# EasyEDA schematic SCH_snap_2025-01-24.json
TITLE: Sheet_1; REV: 1.0; Date: 2025-01-24; Sheet: 1/1; Drawn By: piscitello284; Company: Your Company
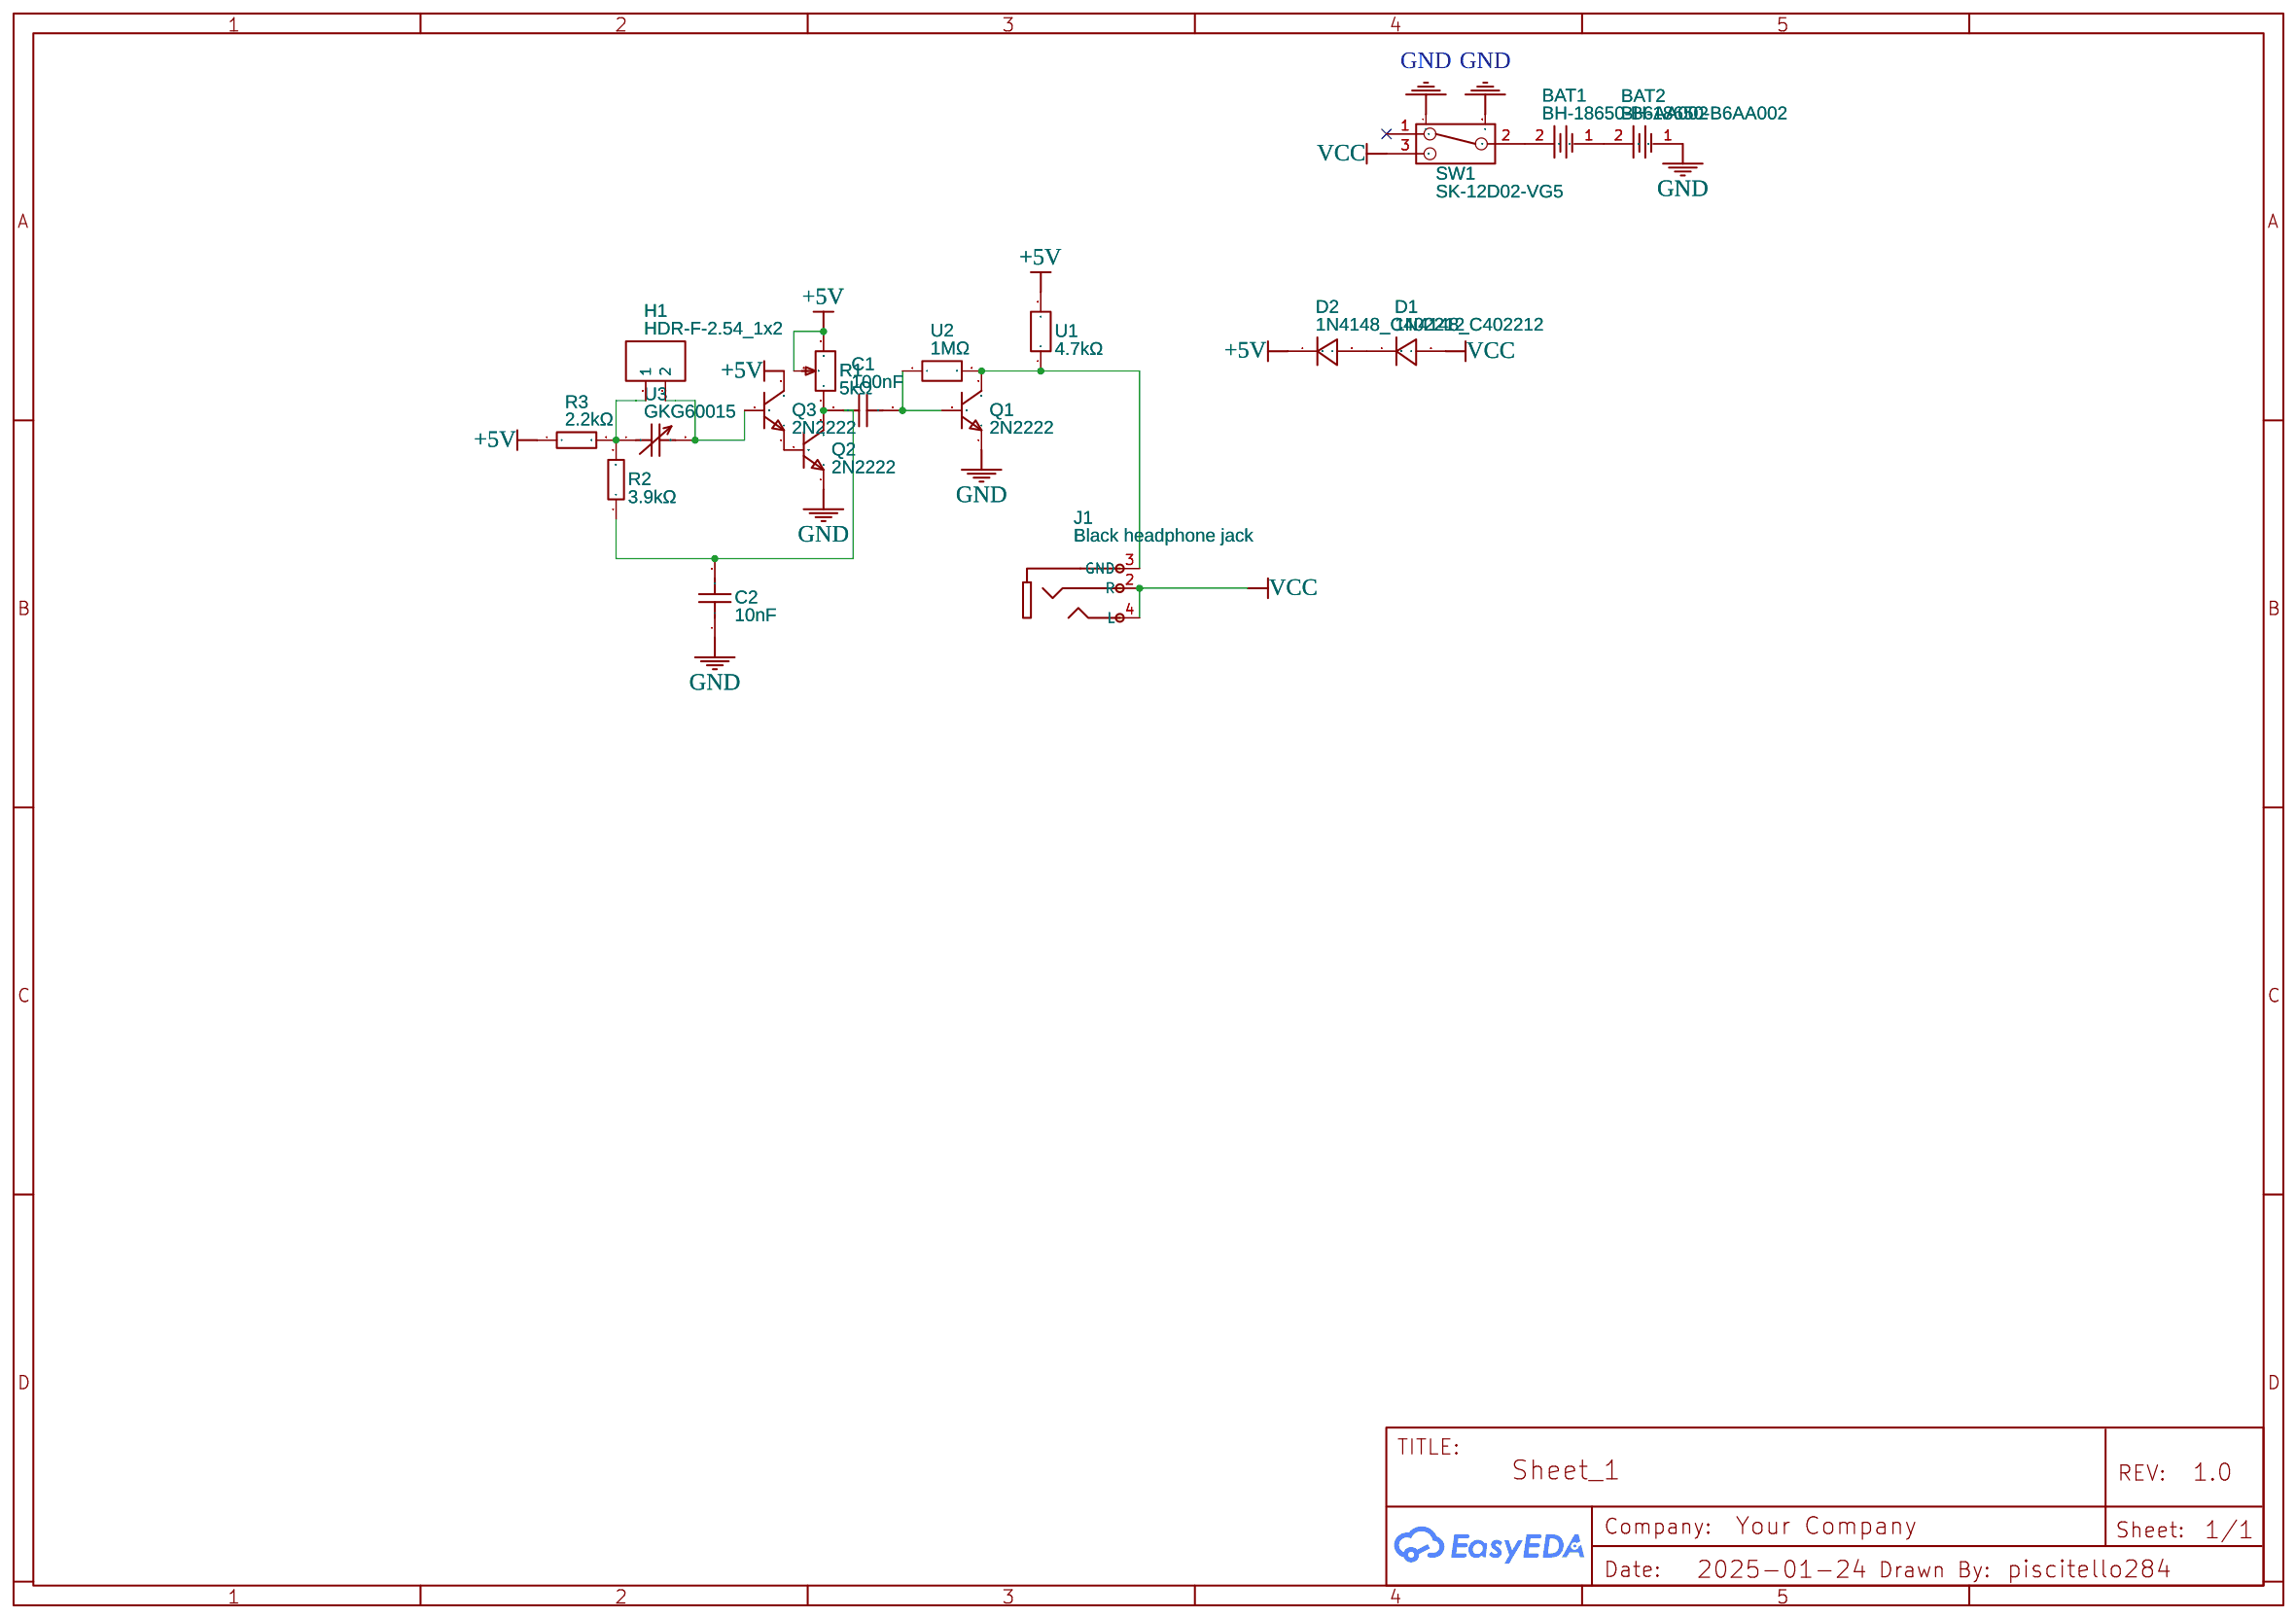
[diagram p0: schematic sheet]

## Parts
BAT1  BH-18650-B6AA002  [BATTERY-SMD_18650-1S-L77.1-W20.7-1]
BAT2  BH-18650-B6AA002  [BATTERY-SMD_18650-1S-L77.1-W20.7-1]
C1  100nF  [CAP-TH_L18.0-W6.0-P15.00-D0.8]
C2  10nF  [CAP-TH_BD2.6-L3.8-P7.80-D0.5]
D1  1N4148_C402212  [DO-35_BD2.0-L4.2-P8.20-D0.5-RD]
D2  1N4148_C402212  [DO-35_BD2.0-L4.2-P8.20-D0.5-RD]
H1  HDR-F-2.54_1x2  [HDR-F-2.54_1X2]
J1  Black headphone jack  [AUDIO-TH_PJ-3200]
Q1  2N2222  [TO-92-3_L4.9-W3.7-P1.27-L]
Q2  2N2222  [TO-92-3_L4.9-W3.7-P1.27-L]
Q3  2N2222  [TO-92-3_L4.9-W3.7-P1.27-L]
R1  5kΩ  [RES-ADJ-TH_3P-L9.5-W9.5-P2.50-L_3386P]
R2  3.9kΩ  [R0603]
R3  2.2kΩ  [R0805]
SW1  SK-12D02-VG5  [SW-TH_SK-12D02VG3]
U1  4.7kΩ  [R2512]
U2  1MΩ  [R0603]
U3  GKG60015  [CAP-TH_GKG60015]

## Library data of the parts
BAT1 BAT2 = BH-18650-B6AA002: Supplier: LCSC; Supplier Part: C7525438; Manufacturer: MYOUNG(美阳); Contributor: lcsc; JLCPCB Part Class: Extended Part
C1 = PX104K2W1502: Contributor: lcsc; Supplier: LCSC; Supplier Part: C3019059; Manufacturer: KYET(科雅); JLCPCB Part Class: Extended Part
C2 = A103K15X7RF5TAA: Contributor: lcsc; Supplier: LCSC; Supplier Part: C3000875; Manufacturer: VISHAY(威世); JLCPCB Part Class: Extended Part
D1 D2 = 1N4148_C402212: Contributor: LCSC; Supplier: LCSC; Supplier Part: C402212; Manufacturer: LGE(鲁光); Manufacturer Part: 1N4148; JLCPCB Part Class: Extended Part
H1 = HDR-F-2.54_1x2: Supplier Part: C49661; Supplier: LCSC; Contributor: LCEDA_Lib
J1 = Black headphone jack: Supplier: LCSC; Manufacturer: BOOMELE(博穆精密); Manufacturer Part: 320B直插; Supplier Part: C18166; JLCPCB Part Class: Extended Part
Q1-Q3 = 2N2222: Contributor: LCSC; Supplier: LCSC; Manufacturer: ST(先科); Manufacturer Part: 2N2222A; Supplier Part: C118536; JLCPCB Part Class: Extended Part
R1 = 3386P-1-502_C330582: Resistance(Ohms): 5K; Contributor: LCSC; Supplier: LCSC; Supplier Part: C330582; Manufacturer: BOCHEN(博晨); Manufacturer Part: 3386P-1-502; JLCPCB Part Class: Extended Part
R2 = RC0603FR-073K9L: Supplier: LCSC; Manufacturer: YAGEO(国巨); Supplier Part: C114616; JLCPCB Part Class: Extended Part
R3 = PTFR0805B2K20N9: Contributor: LCSC; Supplier: LCSC; Supplier Part: C351585; Manufacturer: RESI(开步睿思); JLCPCB Part Class: Extended Part
SW1 = SK-12D02-VG5: Supplier: LCSC; Supplier Part: C136722; Manufacturer: Rectangular Connectors - Contacts; Contributor: LCSC
U1 = SCR2512J4K7: Contributor: lcsc; Supplier: LCSC; Supplier Part: C3018420; Manufacturer: VO(翔胜); JLCPCB Part Class: Extended Part
U2 = SCR0603F1M: Contributor: lcsc; Supplier: LCSC; Supplier Part: C3016422; Manufacturer: VO(翔胜); JLCPCB Part Class: Extended Part
U3 = GKG60015: Supplier: LCSC; Supplier Part: C3273413; Manufacturer: EW Electronics; JLCPCB Part Class: Extended Part; Contributor: lcsc

## Nets
+5V: D2.1(C) Q3.3(C) R1.2 R1.3 R3.1 U1.2
GND: BAT2.1 C2.1 Q1.1(E) Q2.1(E) SW1.4 SW1.5
VCC: D1.2(A) J1.2(R) J1.4(L) SW1.3
Net-(BAT1-1): BAT1.1 BAT2.2
Net-(BAT1-2): BAT1.2 SW1.2
Net-(C1-1): C1.1 C2.2 Q2.3(C) R1.1 R2.1
Net-(C1-2): C1.2 Q1.2(B) U2.1
Net-(D1-1): D1.1(C) D2.2(A)
Net-(H1-1): H1.1 R2.2 R3.2 U3.1
Net-(H1-2): H1.2 Q3.2(B) U3.2
Net-(J1-3): J1.3(GND) Q1.3(C) U1.1 U2.2
Net-(Q2-2): Q2.2(B) Q3.1(E)

Not connected (* = marked no-connect by the designer): SW1 1*
